# EAGLE design radio_board_v0.1 (EAGLE 7.5.0)
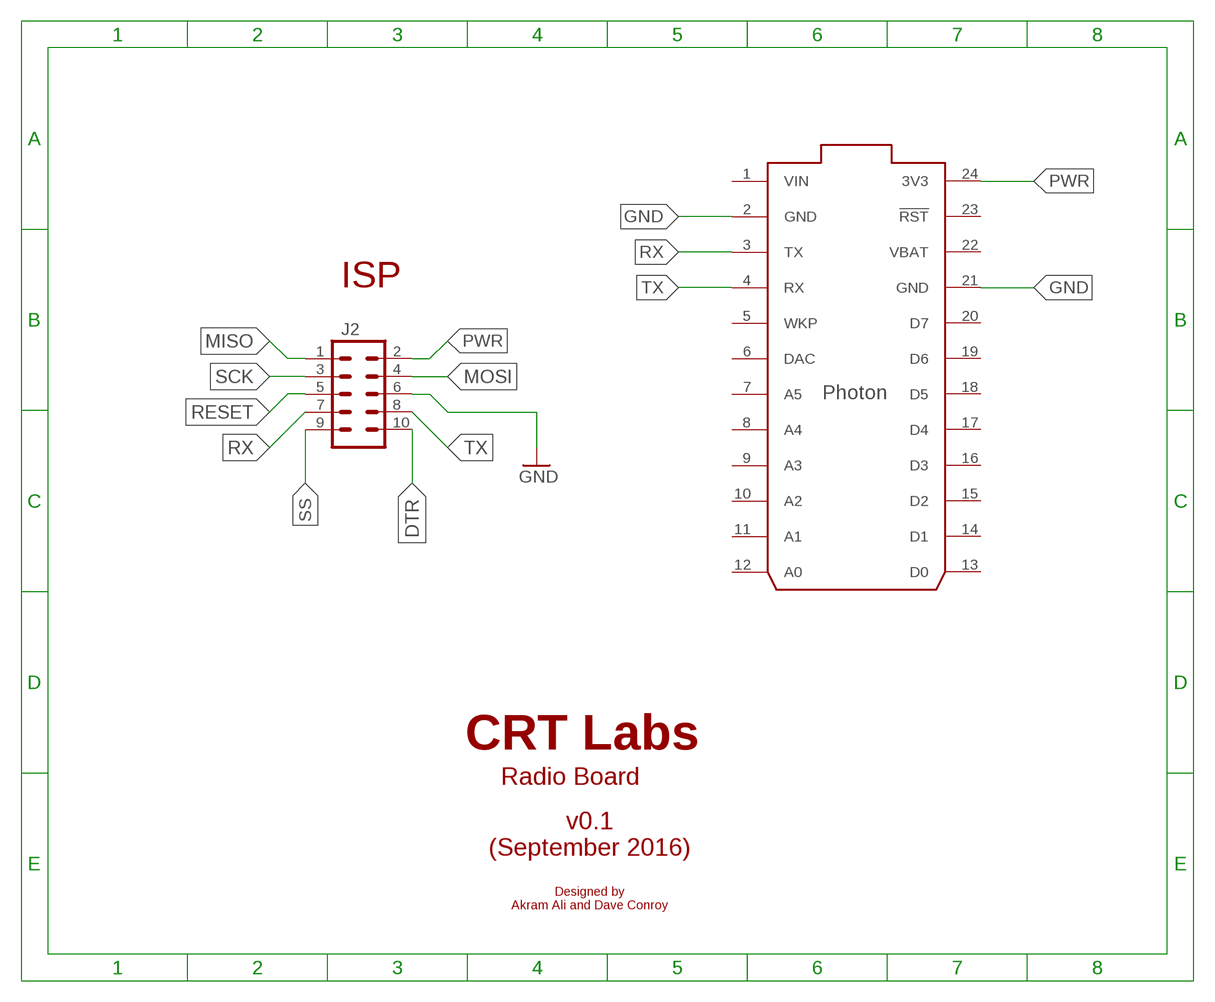
[diagram p0: schematic, sheet 1]

## Parts
J2  M05X2PTH  [AVR_ICSP]
U$1  PHOTON_WITH_HEADERS  [PHOTON]

## Nets
DTR: J2.10
GND: J2.6 U$1.2(GND) U$1.21(GND)
MISO: J2.1
MOSI: J2.4
PWR: J2.2 U$1.24(3V3)
RESET: J2.5
RX: J2.7 U$1.3(TX)
SCK: J2.3
SS: J2.9
TX: J2.8 U$1.4(RX)
Unconnected: U$1.5(WKP) U$1.6(DAC) U$1.7(A5) U$1.8(A4) U$1.9(A3) U$1.10(A2) U$1.11(A1) U$1.12(A0) U$1.13(D0) U$1.14(D1) U$1.15(D2) U$1.16(D3) U$1.17(D4) U$1.18(D5) U$1.19(D6) U$1.20(D7) U$1.23(!RST)

## Notes on the sheet
- ISP
- CRT Labs
- Radio Board
- v0.1
  (September 2016)
- Designed by
  Akram Ali and Dave Conroy

## Power pins joined to a net without a drawn wire
VBAT: U$1.22(VBAT)
VIN: U$1.1(VIN)

## Library data of the parts
J2 = SparkFun-Connectors:M05X2: Header 5x2 Standard 10-pin dual row 0.1" header. Commonly used with AVR-ISP. Use with Spark Fun Electronics SKU: PRT-00778
U$1 = photon:PHOTON

## Board
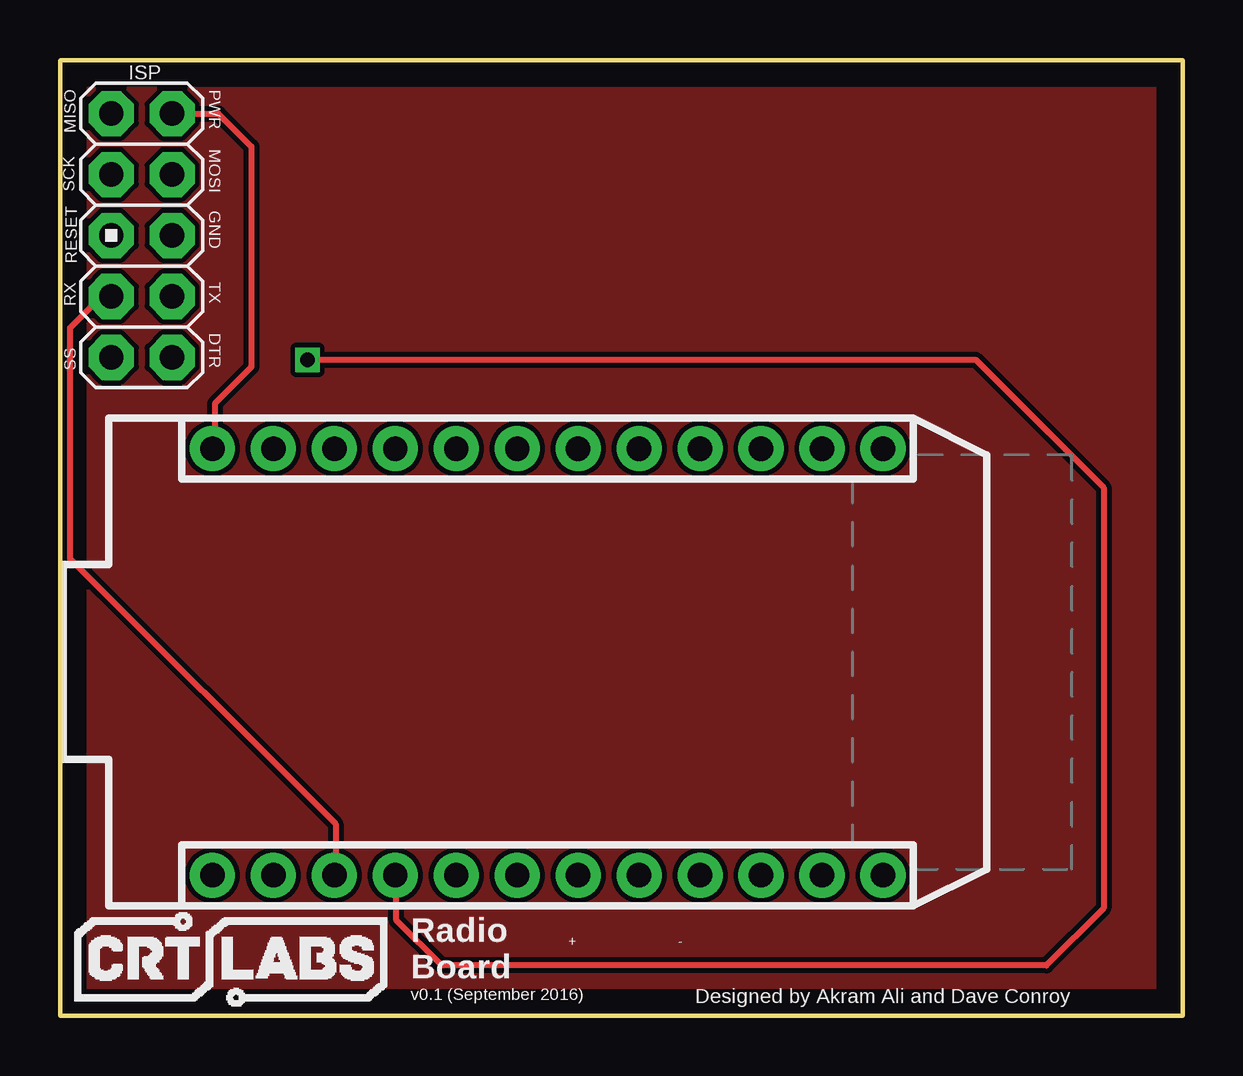
[diagram p1: board, top side]
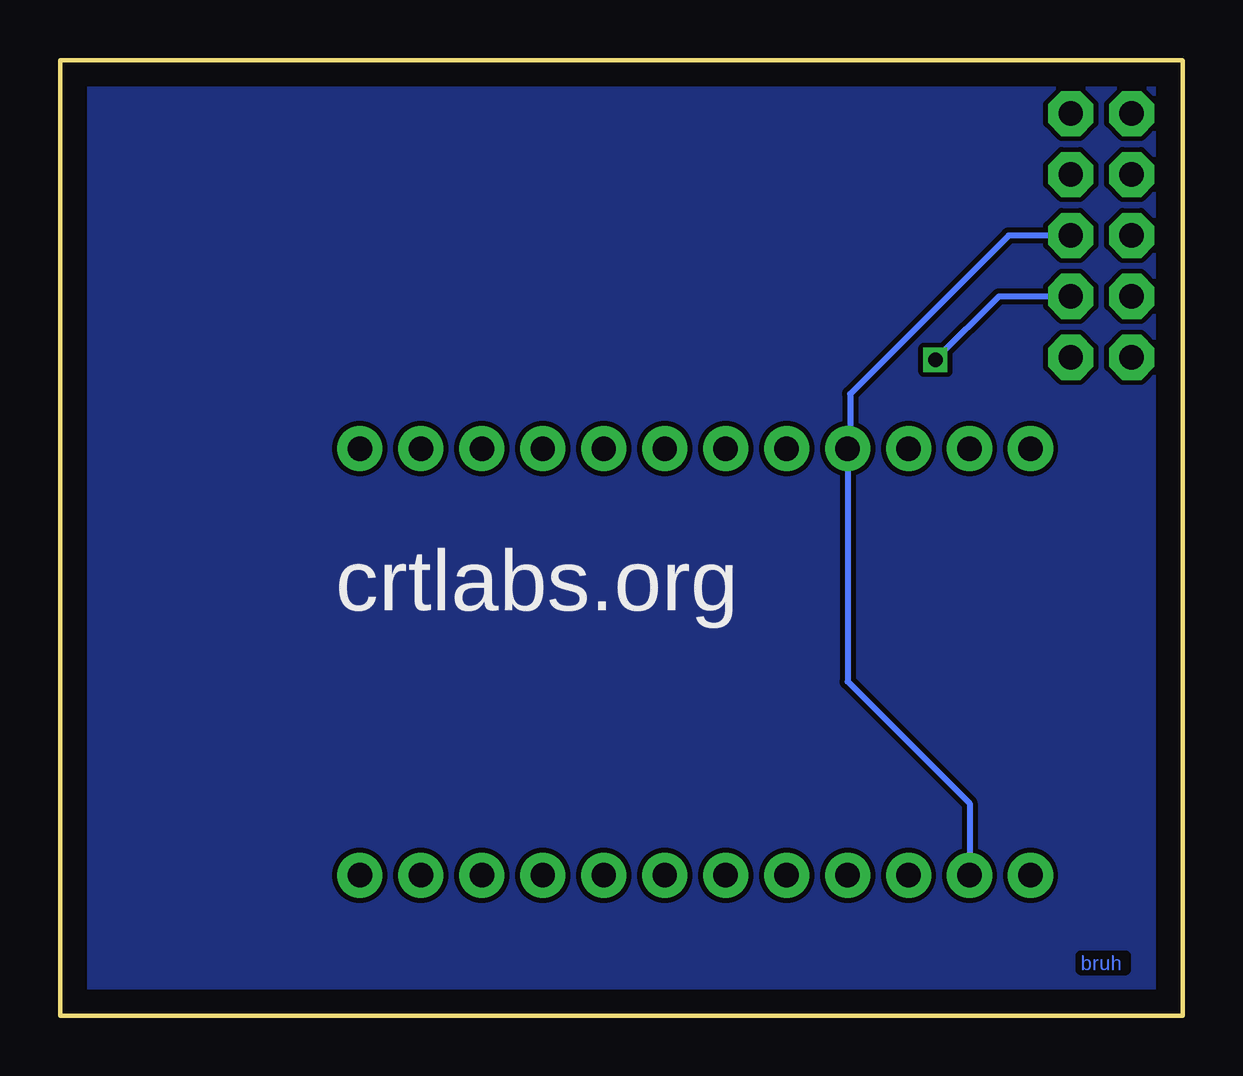
[diagram p2: board, bottom side, seen from below]

Size 46.79 x 39.85 mm. Coordinates in mm from the lower left corner, seen from the top.
Outline: 0.03,39.85 46.79,39.85 46.79,0 0,0 0,39.83
Copper layers (1*16): Top 0.035mm / dielectric 1.5mm / Bottom 0.035mm
Design rules "default": minimum track width 10mil, minimum drill 24mil, track to track 8mil, track to pad 8mil, pad to pad 8mil, via to via 8mil, smd to smd 8mil, copper to edge 40mil, drill to drill 8mil, minimum pad ring 10mil, minimum via ring 8mil, stop-mask expansion 4mil, vias tented up to drill 0mil, thermal gap 10mil

### Footprints (pad centres in the part's own frame; a part is rotated, then mirrored left to right if it is on the bottom)
AVR_ICSP = drill 1.016 pad 1.88 octagon: 1 -1.27,5.08; 2 1.27,5.08; 3 -1.27,2.54; 4 1.27,2.54; 5 -1.27,0; 6 1.27,0; 7 -1.27,-2.54; 8 1.27,-2.54; 9 -1.27,-5.08; 10 1.27,-5.08
PHOTON = drill 1.016 pad 1.88: 1 1.27,32.258; 2 1.27,29.718; 3 1.27,27.178; 4 1.27,24.638; 5 1.27,22.098; 6 1.27,19.558; 7 1.27,17.018; 8 1.27,14.478; 9 1.27,11.938; 10 1.27,9.398; 11 1.27,6.858; 12 1.27,4.318; 13 19.05,4.318; 14 19.05,6.858; 15 19.05,9.398; 16 19.05,11.938; 17 19.05,14.478; 18 19.05,17.018; 19 19.05,19.558; 20 19.05,22.098; 21 19.05,24.638; 22 19.05,27.178; 23 19.05,29.718; 24 19.05,32.258

### Placement (x,y rotation side)
J2  3.4,32.54 0 top
U$1  38.61,4.6 90 top

### Tracks (layer width: path | path; a pad name or v marks a point on that pad's centre or on a via)
GND
  Bottom 0.254: J2.6 7.26,32.54 13.87,25.93 13.87,23.75 U$1.21 13.97,13.94 8.89,8.86 U$1.2
GND0
  pour Top: -0.33,40.28 47.22,40.28 47.22,-0.43 -0.33,-0.43
  pour Bottom: -0.28,40.28 47.12,40.28 47.12,-0.51 -0.3,-0.51 -0.3,40.28
PWR
  Top 0.254: J2.2 6.6,37.62 7.98,36.25 7.98,27.05 6.45,25.53 6.45,23.75 U$1.24
RX
  Top 0.254: J2.7 1.73,30 0.41,28.68 0.41,19.08 11.48,8 11.48,5.92 U$1.3
TX  (via drill 0.6)
  Top 0.254: v10.31,27.36 38.15,27.36 43.49,22.02 43.49,4.5 41.1,2.11 15.9,2.11 14.02,3.99 14.02,5.82 U$1.4
  Bottom 0.254: J2.8 7.67,30 v10.31,27.36

### Text on the board
Bottom: bruh
_tsilk: ISP | PWR | MISO | SCK | MOSI | GND | RESET | RX | TX | SS | DTR | + | - | Radio / Board | v0.1 (September 2016) | Designed by Akram Ali and Dave Conroy
_bsilk: crtlabs.org